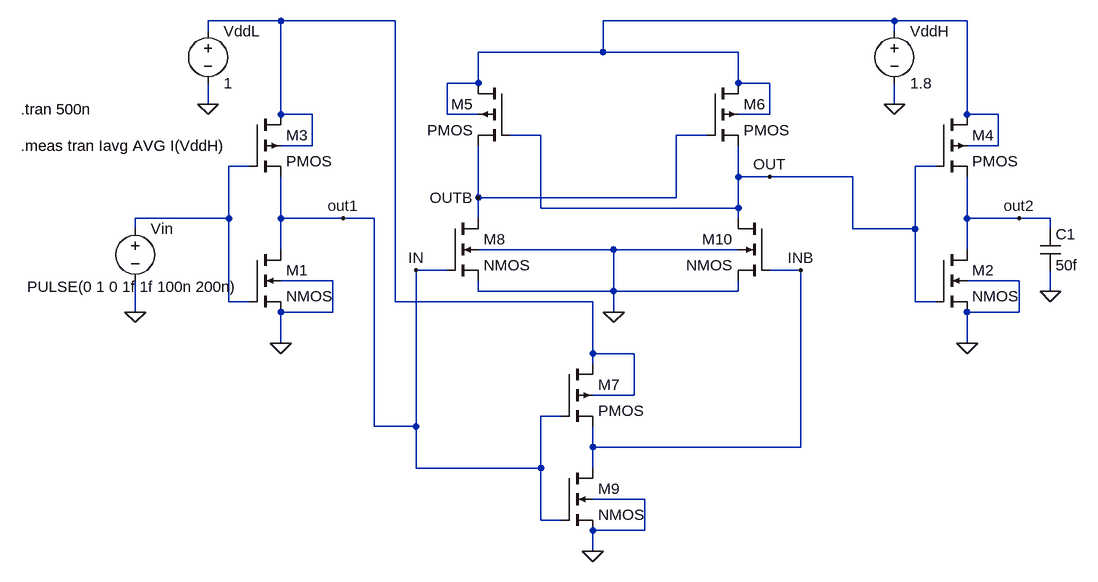
[diagram p0: schematic LC.asc]
LC.asc, the LTspice schematic file:
Version 4.1
SHEET 1 1684 1076
WIRE 320 16 208 16
WIRE 496 16 320 16
WIRE 1264 16 816 16
WIRE 1376 16 1264 16
WIRE 208 32 208 16
WIRE 1264 32 1264 16
WIRE 816 64 816 16
WIRE 816 64 624 64
WIRE 1024 64 816 64
WIRE 624 112 624 64
WIRE 624 112 576 112
WIRE 1024 112 1024 64
WIRE 1072 112 1024 112
WIRE 208 144 208 112
WIRE 1264 144 1264 112
WIRE 320 160 320 16
WIRE 368 160 320 160
WIRE 576 160 576 112
WIRE 624 160 576 160
WIRE 1072 160 1072 112
WIRE 1072 160 1024 160
WIRE 1376 160 1376 16
WIRE 1424 160 1376 160
WIRE 720 192 672 192
WIRE 976 192 928 192
WIRE 368 208 368 160
WIRE 368 208 320 208
WIRE 1424 208 1424 160
WIRE 1424 208 1376 208
WIRE 272 240 240 240
WIRE 1328 240 1296 240
WIRE 1024 256 1024 208
WIRE 1072 256 1024 256
WIRE 1200 256 1072 256
WIRE 624 288 624 208
WIRE 928 288 928 192
WIRE 928 288 624 288
WIRE 720 304 720 192
WIRE 1024 304 1024 256
WIRE 1024 304 720 304
WIRE 240 320 240 240
WIRE 240 320 96 320
WIRE 320 320 320 256
WIRE 416 320 320 320
WIRE 464 320 416 320
WIRE 624 320 624 288
WIRE 1024 320 1024 304
WIRE 1376 320 1376 256
WIRE 1456 320 1376 320
WIRE 1504 320 1456 320
WIRE 96 336 96 320
WIRE 1200 336 1200 256
WIRE 1296 336 1296 240
WIRE 1296 336 1200 336
WIRE 1504 336 1504 320
WIRE 320 368 320 320
WIRE 832 368 624 368
WIRE 1024 368 832 368
WIRE 1376 368 1376 320
WIRE 576 400 528 400
WIRE 1120 400 1072 400
WIRE 400 416 320 416
WIRE 1456 416 1376 416
WIRE 624 432 624 416
WIRE 832 432 832 368
WIRE 832 432 624 432
WIRE 1024 432 1024 416
WIRE 1024 432 832 432
WIRE 1504 432 1504 400
WIRE 240 448 240 320
WIRE 272 448 240 448
WIRE 496 448 496 16
WIRE 800 448 496 448
WIRE 1296 448 1296 336
WIRE 1328 448 1296 448
WIRE 96 464 96 416
WIRE 400 464 400 416
WIRE 400 464 320 464
WIRE 832 464 832 432
WIRE 1456 464 1456 416
WIRE 1456 464 1376 464
WIRE 320 512 320 464
WIRE 1376 512 1376 464
WIRE 800 528 800 448
WIRE 864 528 800 528
WIRE 800 544 800 528
WIRE 864 592 864 528
WIRE 864 592 800 592
WIRE 752 624 720 624
WIRE 464 640 464 320
WIRE 528 640 528 400
WIRE 528 640 464 640
WIRE 800 672 800 640
WIRE 1120 672 1120 400
WIRE 1120 672 800 672
WIRE 528 704 528 640
WIRE 720 704 720 624
WIRE 720 704 528 704
WIRE 800 704 800 672
WIRE 880 752 800 752
WIRE 720 784 720 704
WIRE 752 784 720 784
WIRE 880 800 880 752
WIRE 880 800 800 800
WIRE 800 832 800 800
FLAG 208 144 0
FLAG 1264 144 0
FLAG 320 512 0
FLAG 1376 512 0
FLAG 96 464 0
FLAG 416 320 out1
FLAG 1456 320 out2
FLAG 1504 432 0
FLAG 832 464 0
FLAG 800 832 0
FLAG 624 288 OUTB
FLAG 1072 256 OUT
FLAG 1120 400 INB
FLAG 528 400 IN
SYMBOL nmos4 272 368 R0
SYMATTR InstName M1
SYMATTR Value2 l=180n w=1u
SYMBOL nmos4 1328 368 R0
SYMATTR InstName M2
SYMATTR Value2 l=180n w=1u
SYMBOL pmos4 272 160 R0
SYMATTR InstName M3
SYMATTR Value2 l=180n w=2u
SYMBOL pmos4 1328 160 R0
SYMATTR InstName M4
SYMATTR Value2 l=180n w=2u
SYMBOL voltage 208 16 R0
WINDOW 123 0 0 Left 0
WINDOW 39 0 0 Left 0
SYMATTR InstName VddL
SYMATTR Value 1
SYMBOL voltage 1264 16 R0
WINDOW 123 0 0 Left 0
WINDOW 39 0 0 Left 0
SYMATTR InstName VddH
SYMATTR Value 1.8
SYMBOL voltage 96 320 R0
WINDOW 3 -166 105 Left 2
WINDOW 123 0 0 Left 0
WINDOW 39 0 0 Left 0
SYMATTR Value PULSE(0 1 0 1f 1f 100n 200n)
SYMATTR InstName Vin
SYMBOL cap 1488 336 R0
SYMATTR InstName C1
SYMATTR Value 50f
SYMBOL pmos4 672 112 M0
SYMATTR InstName M5
SYMATTR Value2 l=180n w=2u
SYMBOL pmos4 976 112 R0
SYMATTR InstName M6
SYMATTR Value2 l=180n w=2u
SYMBOL pmos4 752 544 R0
SYMATTR InstName M7
SYMATTR Value2 l=180n w=2u
SYMBOL nmos4 576 320 R0
SYMATTR InstName M8
SYMATTR Value2 l=180n w=1u
SYMBOL nmos4 752 704 R0
SYMATTR InstName M9
SYMATTR Value2 l=180n w=1u
SYMBOL nmos4 1072 320 M0
SYMATTR InstName M10
SYMATTR Value2 l=180n w=1u
TEXT -80 152 Left 2 !.tran 500n
TEXT -80 208 Left 2 !.meas tran Iavg AVG I(VddH)

The netlist it stands for:
* LC.asc
M1 IN N003 0 0 NMOS l=180n w=1u
M2 out2 OUT 0 0 NMOS l=180n w=1u
M3 N001 N003 IN N001 PMOS l=180n w=2u
M4 N002 OUT out2 N002 PMOS l=180n w=2u
VddL N001 0 1
VddH N002 0 1.8
Vin N003 0 PULSE(0 1 0 1f 1f 100n 200n)
C1 out2 0 50f
M5 N002 OUT OUTB N002 PMOS l=180n w=2u
M6 N002 OUTB OUT N002 PMOS l=180n w=2u
M7 N001 IN INB N001 PMOS l=180n w=2u
M8 OUTB IN 0 0 NMOS l=180n w=1u
M9 INB IN 0 0 NMOS l=180n w=1u
M10 OUT INB 0 0 NMOS l=180n w=1u
.model NMOS NMOS
.model PMOS PMOS
.lib standard.mos
.tran 500n
.meas tran Iavg AVG I(VddH)
.backanno
.end

* Results of the author's LTspice run, read from the files saved beside the schematic
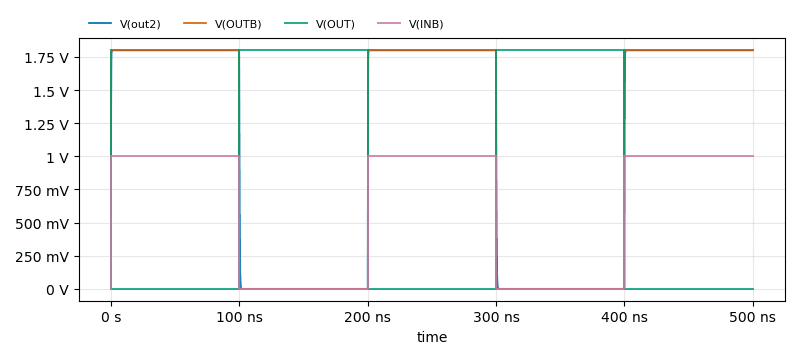
[diagram p1: Transient Analysis of LC.asc, plotted from the saved traces]
* Transient Analysis, 1 run:
*   V(out2): min 0 V, max 1.8 V, average 1.081 V, rms 1.393 V, last 1.8 V
*   V(OUTB): min 0 V, max 1.8 V, average 1.08 V, rms 1.394 V, last 1.8 V
*   V(OUT): min 0 V, max 1.8 V, average 720 mV, rms 1.138 V, last 0 V
*   V(INB): min 0 V, max 1 V, average 600 mV, rms 774.6 mV, last 1 V
* From the log:
*   iavg: AVG(I(VddH))=-5.40000333733e-07 FROM 0 TO 5e-07